# Altium project XL52832.PrjPCB
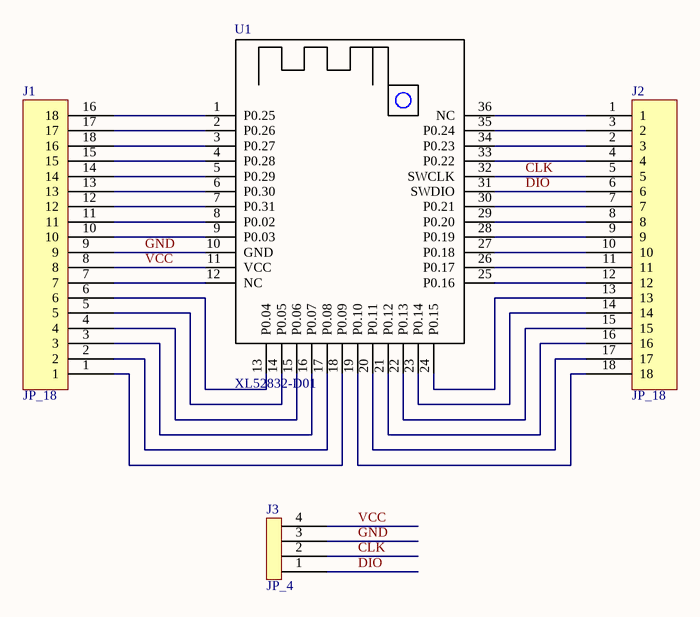
[diagram p0: XL52832.SchDoc]
1 sheet, 4 parts. Net scope: global (net labels, ports and power ports of the same name join across sheets).
Board file: XL52832.PcbDoc

## Sheet XL52832.SchDoc
size A

### Parts
J1  JP_18  [JP_18]
J2  JP_18  [JP_18]
J3  JP_4  [JP_4]
U1  XL52832-D01  [XL52832-D01]

### Nets
CLK: J2.5 J3.2 U1.32(SWCLK)
DIO: J2.6 J3.1 U1.31(SWDIO)
GND: J1.9 J3.3 U1.10(GND)
VCC: J1.8 J3.4 U1.11(VCC)
NetJ1_1: J1.1 U1.18(P0.09)
NetJ1_2: J1.2 U1.17(P0.08)
NetJ1_3: J1.3 U1.16(P0.07)
NetJ1_4: J1.4 U1.15(P0.06)
NetJ1_5: J1.5 U1.14(P0.05)
NetJ1_6: J1.6 U1.13(P0.04)
NetJ1_7: J1.7 U1.12(NC)
NetJ1_10: J1.10 U1.9(P0.03)
NetJ1_11: J1.11 U1.8(P0.02)
NetJ1_12: J1.12 U1.7(P0.31)
NetJ1_13: J1.13 U1.6(P0.30)
NetJ1_14: J1.14 U1.5(P0.29)
NetJ1_15: J1.15 U1.4(P0.28)
NetJ1_16: J1.16(18) U1.1(P0.25)
NetJ1_17: J1.17 U1.2(P0.26)
NetJ1_18: J1.18(16) U1.3(P0.27)
NetJ2_1: J2.1 U1.36(NC)
NetJ2_2: J2.2(3) U1.34(P0.23)
NetJ2_3: J2.3(2) U1.35(P0.24)
NetJ2_4: J2.4 U1.33(P0.22)
NetJ2_7: J2.7 U1.30(P0.21)
NetJ2_8: J2.8 U1.29(P0.20)
NetJ2_9: J2.9 U1.28(P0.19)
NetJ2_10: J2.10 U1.27(P0.18)
NetJ2_11: J2.11 U1.26(P0.17)
NetJ2_12: J2.12 U1.25(P0.16)
NetJ2_13: J2.13 U1.24(P0.15)
NetJ2_14: J2.14 U1.23(P0.14)
NetJ2_15: J2.15 U1.22(P0.13)
NetJ2_16: J2.16 U1.21(P0.12)
NetJ2_17: J2.17 U1.20(P0.11)
NetJ2_18: J2.18 U1.19(P0.10)